# Altium schematic sheet mppt.SchDoc: ChangeMe
size D; Date: Not shown in title block; ApprovedBy: Not shown in title block; CheckedBy: Not shown in title block; Author: Not shown in title block; CompanyName: Not shown in title block; DrawnBy: Not shown in title block; Engineer: Not shown in title block; Organization: Not shown in title block; Address1: Not shown in title block; Address2: Not shown in title block; Address3: Not shown in title block; Address4: Not shown in title block; DocumentNumber: 1; Revision: Use project parameter SCH_Rev; SheetNumber: 1; SheetTotal: 1; PageSetup: Record=PageOptions|CenterHorizontal=True|CenterVertical=True|PrintScale=0.85|XCorrection=0.00|YCorrection=0.00|PrintKind=2|BorderSize=5000000|LeftOffset=0|BottomOffset=0|Orientation=2|PaperLength=1000|PaperWidth=1000|Scale=100|PaperSource=15|PrintQuality=600|MediaType=1|DitherType=10|PaperKind=11x17|PrintScaleMode=0; CurrentTime: Not shown in title block; CurrentDate: Not shown in title block; Time: Not shown in title block; DocumentFullPathAndName: Not shown in title block; DocumentName: Not shown in title block; ModifiedDate: Not shown in title block; ImagePath: Not shown in title block
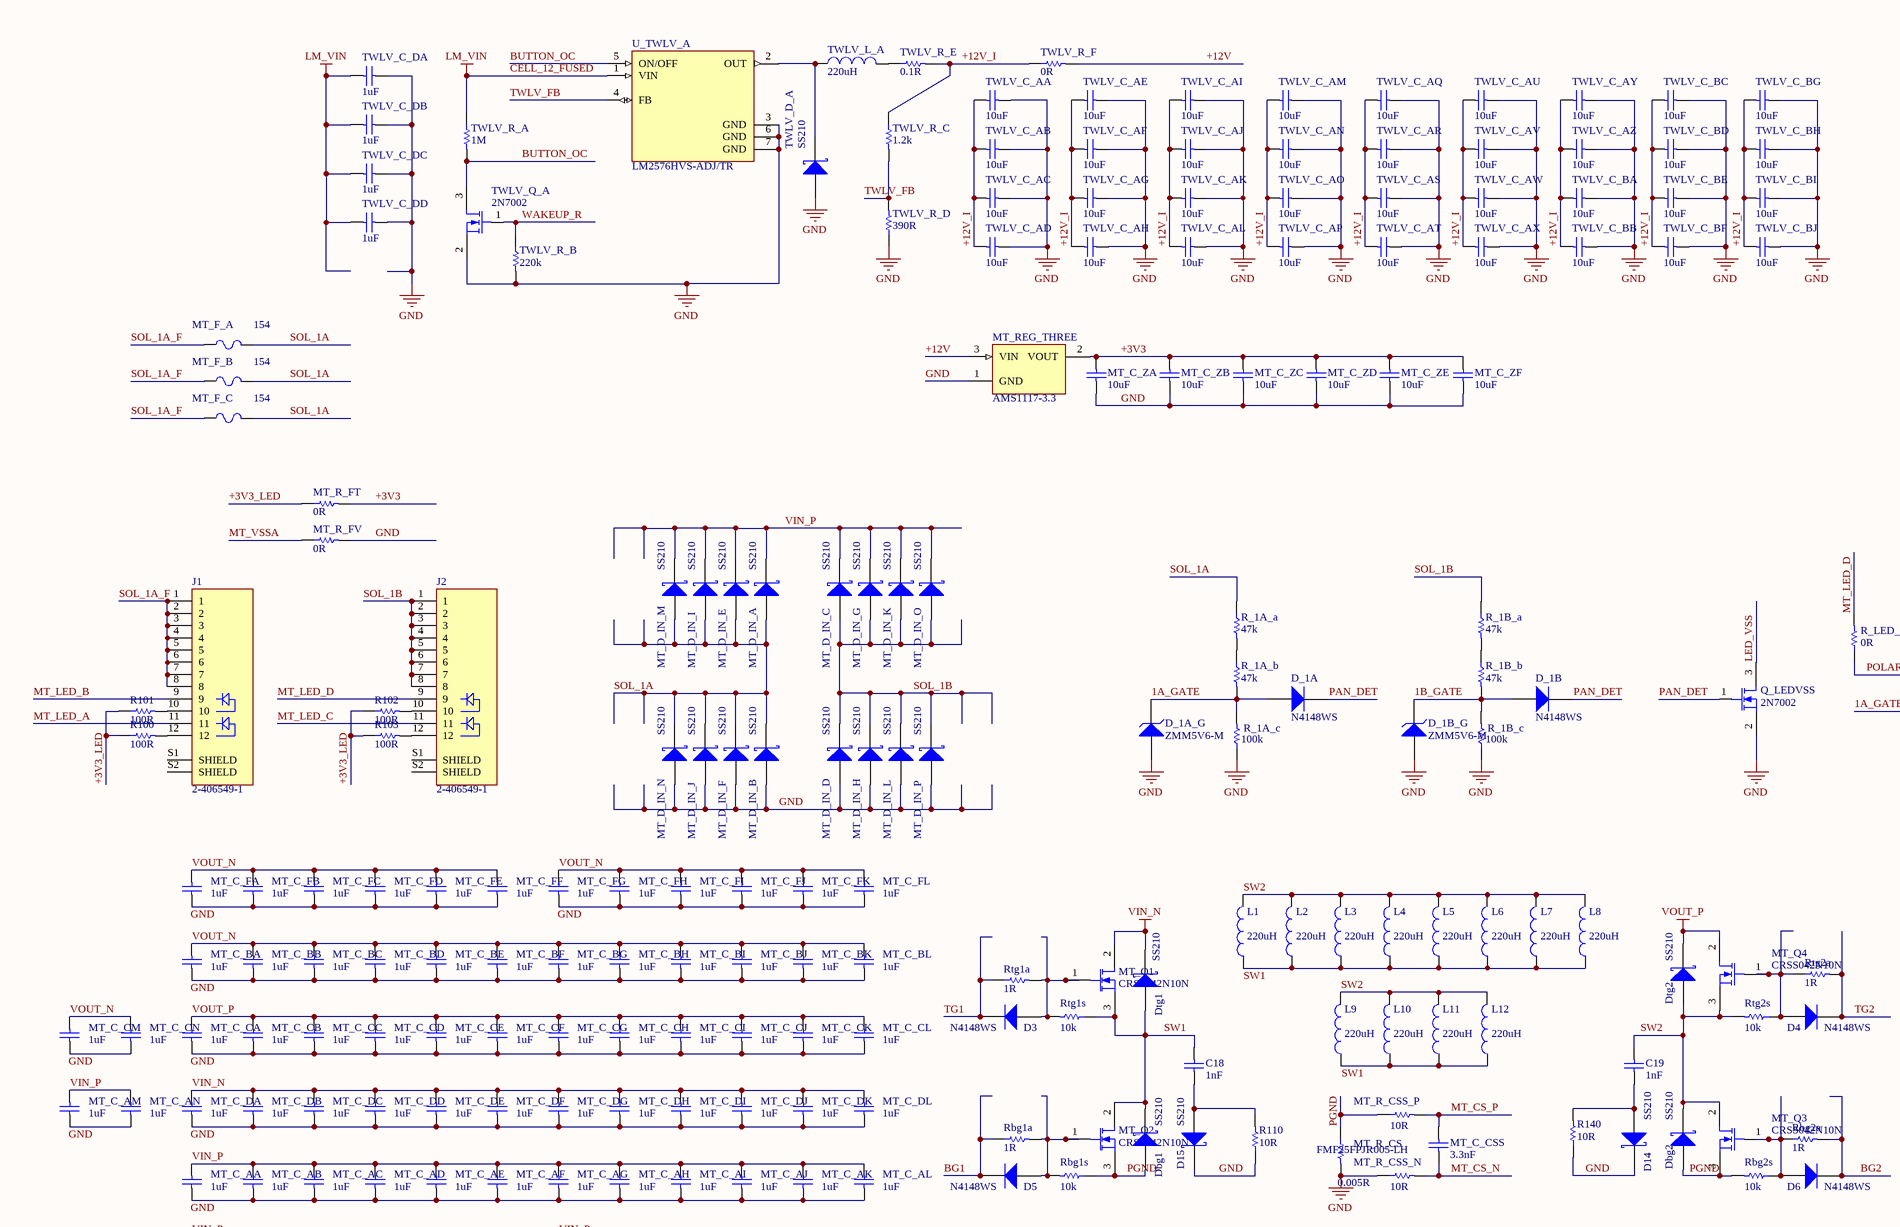
[diagram p0: mppt.SchDoc, top left]
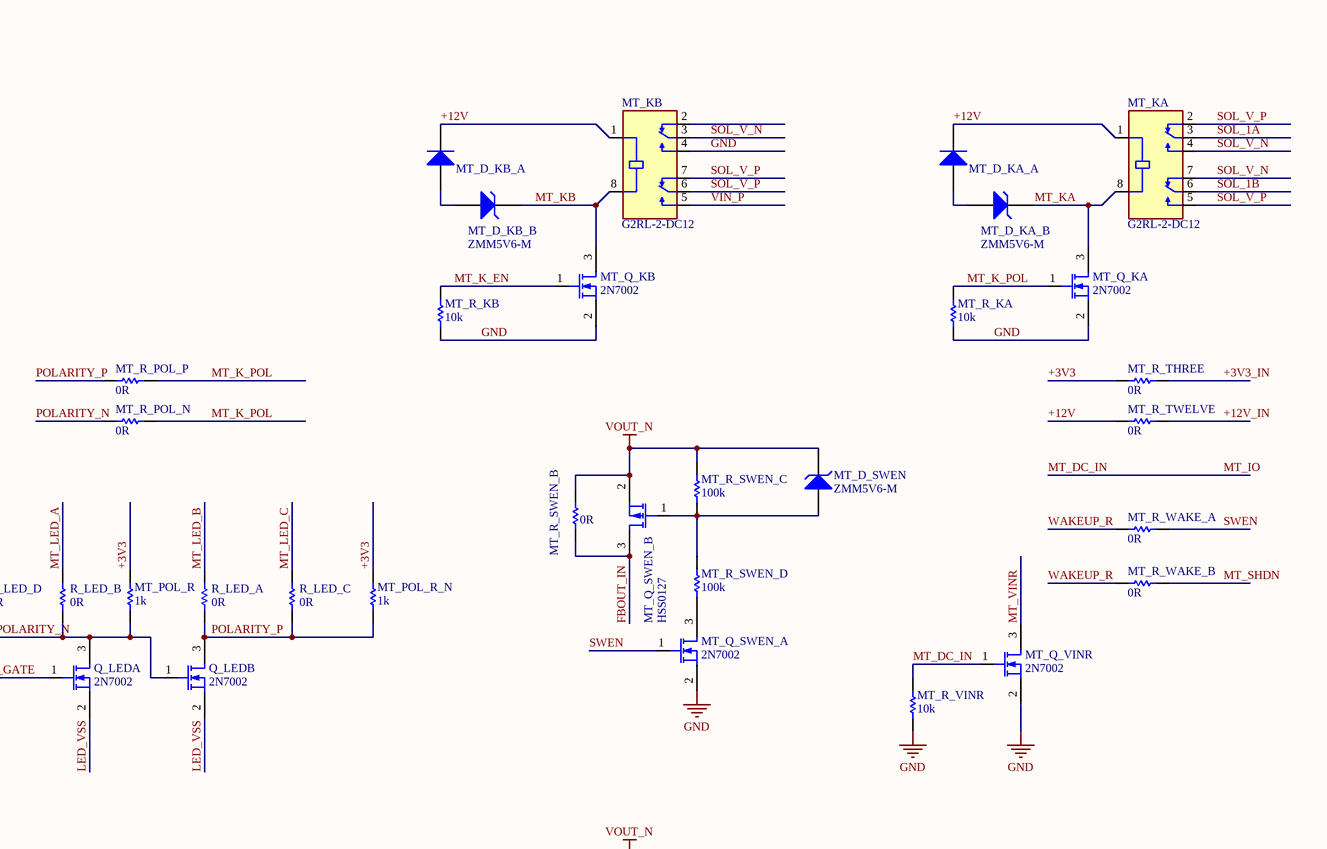
[diagram p1: mppt.SchDoc, top right]
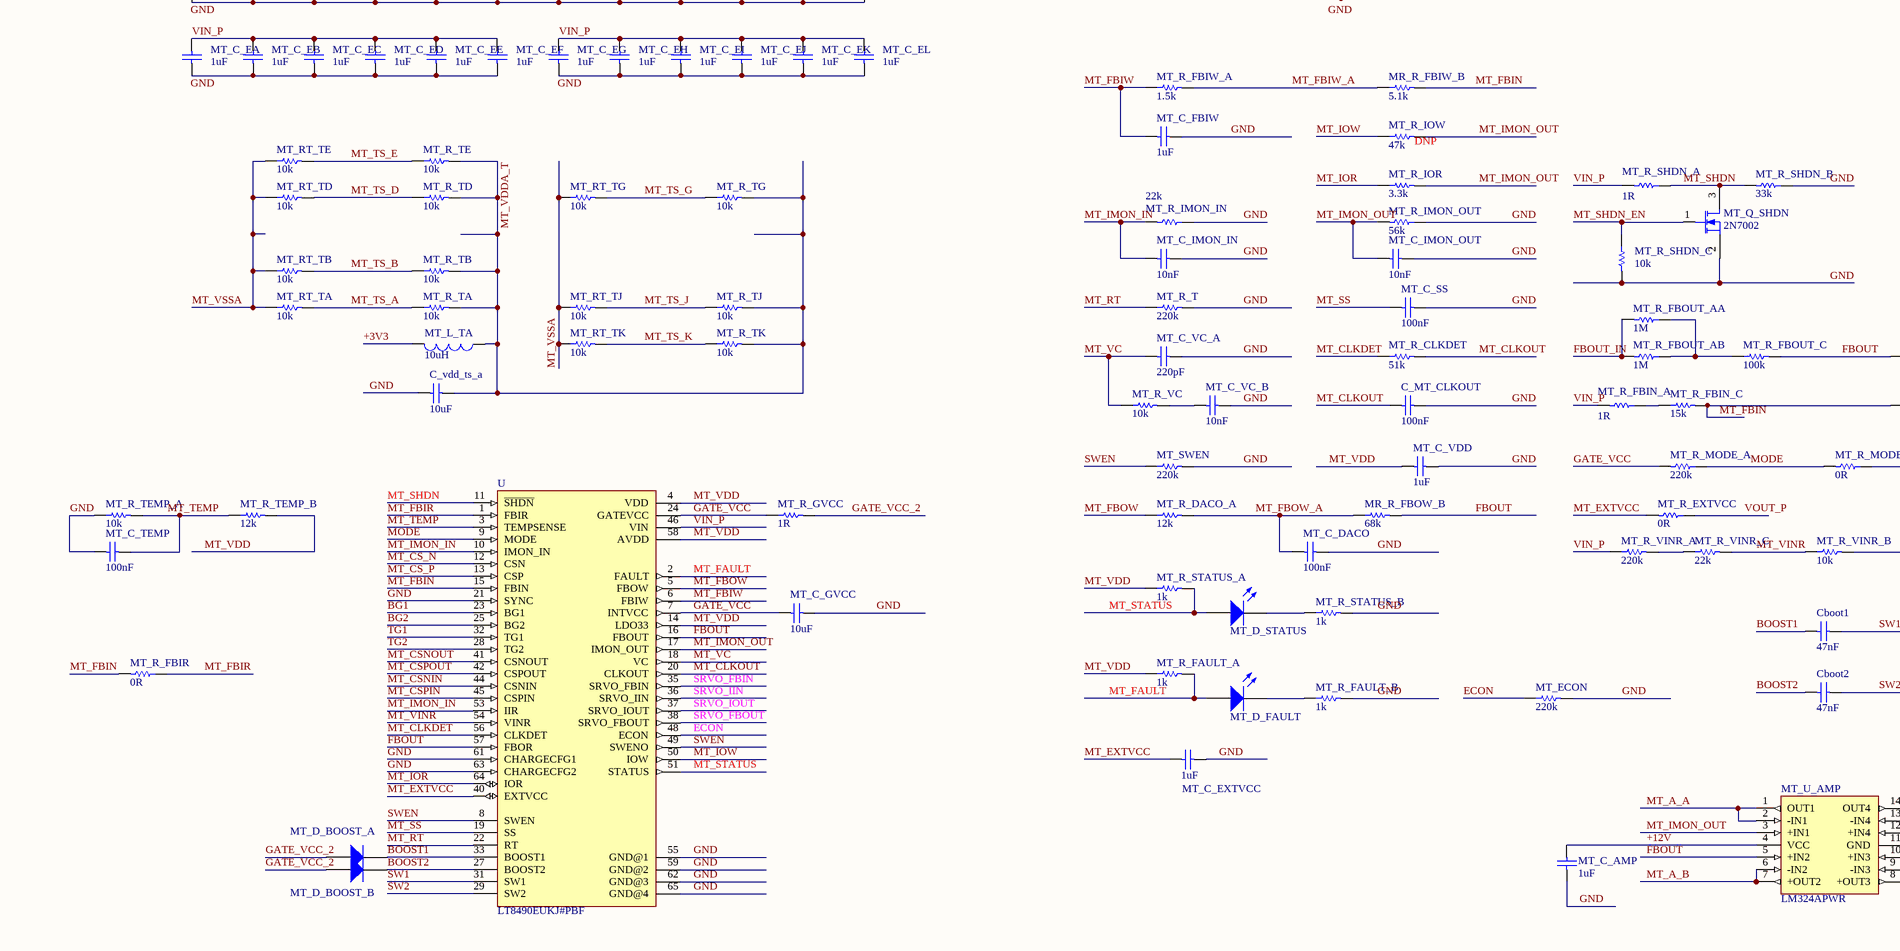
[diagram p2: mppt.SchDoc, bottom left]
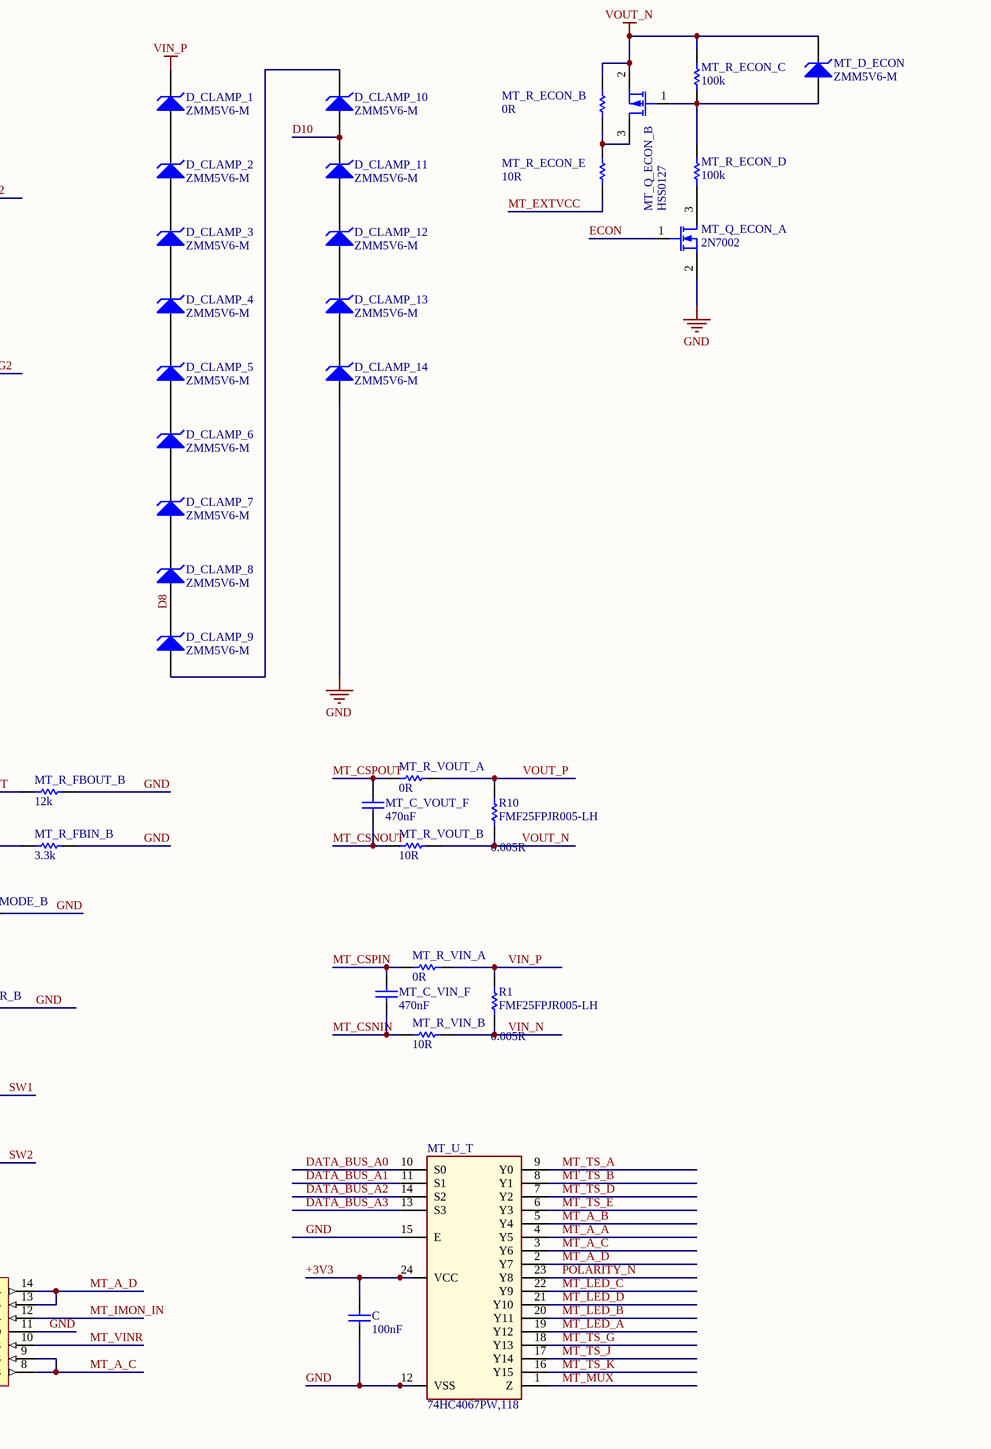
[diagram p3: mppt.SchDoc, bottom right]

## Parts
C  value 100nF  [C_0402]  (hidden comment: CL05B104KO5NNNC)
C18  value 1nF  [C_1206]  (hidden comment: 1206B102K202NT)
C19  value 1nF  [C_1206]  (hidden comment: 1206B102K202NT)
C_MT_CLKOUT  value 100nF  [C_0402]  (hidden comment: CL05B104KO5NNNC)
C_vdd_ts_a  value 10uF  [C_0402]  (hidden comment: CL05A106MQ5NUNC)
Cboot1  value 47nF  [C_0603]  (hidden comment: CL10B474KA8NNNC)
Cboot2  value 47nF  [C_0603]  (hidden comment: CL10B474KA8NNNC)
D3  N4148WS  [SOD-323]
D4  N4148WS  [SOD-323]
D5  N4148WS  [SOD-323]
D6  N4148WS  [SOD-323]
D14  SS210  [DO-214AC]
D15  SS210  [DO-214AC]
D_1A  N4148WS  [SOD-323]
D_1A_G  ZMM5V6-M  [DO-213AA]
D_1B  N4148WS  [SOD-323]
D_1B_G  ZMM5V6-M  [DO-213AA]
D_CLAMP_1  ZMM5V6-M  [DO-213AA]
D_CLAMP_2  ZMM5V6-M  [DO-213AA]
D_CLAMP_3  ZMM5V6-M  [DO-213AA]
D_CLAMP_4  ZMM5V6-M  [DO-213AA]
D_CLAMP_5  ZMM5V6-M  [DO-213AA]
D_CLAMP_6  ZMM5V6-M  [DO-213AA]
D_CLAMP_7  ZMM5V6-M  [DO-213AA]
D_CLAMP_8  ZMM5V6-M  [DO-213AA]
D_CLAMP_9  ZMM5V6-M  [DO-213AA]
D_CLAMP_10  ZMM5V6-M  [DO-213AA]
D_CLAMP_11  ZMM5V6-M  [DO-213AA]
D_CLAMP_12  ZMM5V6-M  [DO-213AA]
D_CLAMP_13  ZMM5V6-M  [DO-213AA]
D_CLAMP_14  ZMM5V6-M  [DO-213AA]
Dbg1  SS210  [DO-214AC]
Dbg2  SS210  [DO-214AC]
Dtg1  SS210  [DO-214AC]
Dtg2  SS210  [DO-214AC]
J1  2-406549-1  [TE_2-406549-1]
J2  2-406549-1  [TE_2-406549-1]
L1  value 220uH  [SRR1260]  (hidden comment: SWRB1207S-221MT)
L2  value 220uH  [SRR1260]  (hidden comment: SWRB1207S-221MT)
L3  value 220uH  [SRR1260]  (hidden comment: SWRB1207S-221MT)
L4  value 220uH  [SRR1260]  (hidden comment: SWRB1207S-221MT)
L5  value 220uH  [SRR1260]  (hidden comment: SWRB1207S-221MT)
L6  value 220uH  [SRR1260]  (hidden comment: SWRB1207S-221MT)
L7  value 220uH  [SRR1260]  (hidden comment: SWRB1207S-221MT)
L8  value 220uH  [SRR1260]  (hidden comment: SWRB1207S-221MT)
L9  value 220uH  [SRR1260]  (hidden comment: SWRB1207S-221MT)
L10  value 220uH  [SRR1260]  (hidden comment: SWRB1207S-221MT)
L11  value 220uH  [SRR1260]  (hidden comment: SWRB1207S-221MT)
L12  value 220uH  [SRR1260]  (hidden comment: SWRB1207S-221MT)
MR_R_FBIW_B  value 5.1k  [R_0402]  (hidden comment: 0402WGF5101TCE)
MR_R_FBOW_B  value 68k  [R_0402]  (hidden comment: 0402WGF6802TCE)
MT_C_AA  value 1uF  [C_1206]  (hidden comment: 1206B105K101NT)
MT_C_AB  value 1uF  [C_1206]  (hidden comment: 1206B105K101NT)
MT_C_AC  value 1uF  [C_1206]  (hidden comment: 1206B105K101NT)
MT_C_AD  value 1uF  [C_1206]  (hidden comment: 1206B105K101NT)
MT_C_AE  value 1uF  [C_1206]  (hidden comment: 1206B105K101NT)
MT_C_AF  value 1uF  [C_1206]  (hidden comment: 1206B105K101NT)
MT_C_AG  value 1uF  [C_1206]  (hidden comment: 1206B105K101NT)
MT_C_AH  value 1uF  [C_1206]  (hidden comment: 1206B105K101NT)
MT_C_AI  value 1uF  [C_1206]  (hidden comment: 1206B105K101NT)
MT_C_AJ  value 1uF  [C_1206]  (hidden comment: 1206B105K101NT)
MT_C_AK  value 1uF  [C_1206]  (hidden comment: 1206B105K101NT)
MT_C_AL  value 1uF  [C_1206]  (hidden comment: 1206B105K101NT)
MT_C_AM  value 1uF  [C_1206]  (hidden comment: 1206B105K101NT)
MT_C_AMP  value 1uF  [C_0402]  (hidden comment: CL05A105KA5NQNC)
MT_C_AN  value 1uF  [C_1206]  (hidden comment: 1206B105K101NT)
MT_C_BA  value 1uF  [C_1206]  (hidden comment: 1206B105K101NT)
MT_C_BB  value 1uF  [C_1206]  (hidden comment: 1206B105K101NT)
MT_C_BC  value 1uF  [C_1206]  (hidden comment: 1206B105K101NT)
MT_C_BD  value 1uF  [C_1206]  (hidden comment: 1206B105K101NT)
MT_C_BE  value 1uF  [C_1206]  (hidden comment: 1206B105K101NT)
MT_C_BF  value 1uF  [C_1206]  (hidden comment: 1206B105K101NT)
MT_C_BG  value 1uF  [C_1206]  (hidden comment: 1206B105K101NT)
MT_C_BH  value 1uF  [C_1206]  (hidden comment: 1206B105K101NT)
MT_C_BI  value 1uF  [C_1206]  (hidden comment: 1206B105K101NT)
MT_C_BJ  value 1uF  [C_1206]  (hidden comment: 1206B105K101NT)
MT_C_BK  value 1uF  [C_1206]  (hidden comment: 1206B105K101NT)
MT_C_BL  value 1uF  [C_1206]  (hidden comment: 1206B105K101NT)
MT_C_CA  value 1uF  [C_1206]  (hidden comment: 1206B105K101NT)
MT_C_CB  value 1uF  [C_1206]  (hidden comment: 1206B105K101NT)
MT_C_CC  value 1uF  [C_1206]  (hidden comment: 1206B105K101NT)
MT_C_CD  value 1uF  [C_1206]  (hidden comment: 1206B105K101NT)
MT_C_CE  value 1uF  [C_1206]  (hidden comment: 1206B105K101NT)
MT_C_CF  value 1uF  [C_1206]  (hidden comment: 1206B105K101NT)
MT_C_CG  value 1uF  [C_1206]  (hidden comment: 1206B105K101NT)
MT_C_CH  value 1uF  [C_1206]  (hidden comment: 1206B105K101NT)
MT_C_CI  value 1uF  [C_1206]  (hidden comment: 1206B105K101NT)
MT_C_CJ  value 1uF  [C_1206]  (hidden comment: 1206B105K101NT)
MT_C_CK  value 1uF  [C_1206]  (hidden comment: 1206B105K101NT)
MT_C_CL  value 1uF  [C_1206]  (hidden comment: 1206B105K101NT)
MT_C_CM  value 1uF  [C_1206]  (hidden comment: 1206B105K101NT)
MT_C_CN  value 1uF  [C_1206]  (hidden comment: 1206B105K101NT)
MT_C_CSS  value 3.3nF  [C_0402]  (hidden comment: CL05B332KB5NNNC)
MT_C_DA  value 1uF  [C_1206]  (hidden comment: 1206B105K101NT)
MT_C_DACO  value 100nF  [C_0402]  (hidden comment: CL05B104KO5NNNC)
MT_C_DB  value 1uF  [C_1206]  (hidden comment: 1206B105K101NT)
MT_C_DC  value 1uF  [C_1206]  (hidden comment: 1206B105K101NT)
MT_C_DD  value 1uF  [C_1206]  (hidden comment: 1206B105K101NT)
MT_C_DE  value 1uF  [C_1206]  (hidden comment: 1206B105K101NT)
MT_C_DF  value 1uF  [C_1206]  (hidden comment: 1206B105K101NT)
MT_C_DG  value 1uF  [C_1206]  (hidden comment: 1206B105K101NT)
MT_C_DH  value 1uF  [C_1206]  (hidden comment: 1206B105K101NT)
MT_C_DI  value 1uF  [C_1206]  (hidden comment: 1206B105K101NT)
MT_C_DJ  value 1uF  [C_1206]  (hidden comment: 1206B105K101NT)
MT_C_DK  value 1uF  [C_1206]  (hidden comment: 1206B105K101NT)
MT_C_DL  value 1uF  [C_1206]  (hidden comment: 1206B105K101NT)
MT_C_EA  value 1uF  [C_1206]  (hidden comment: 1206B105K101NT)
MT_C_EB  value 1uF  [C_1206]  (hidden comment: 1206B105K101NT)
MT_C_EC  value 1uF  [C_1206]  (hidden comment: 1206B105K101NT)
MT_C_ED  value 1uF  [C_1206]  (hidden comment: 1206B105K101NT)
MT_C_EE  value 1uF  [C_1206]  (hidden comment: 1206B105K101NT)
MT_C_EF  value 1uF  [C_1206]  (hidden comment: 1206B105K101NT)
MT_C_EG  value 1uF  [C_1206]  (hidden comment: 1206B105K101NT)
MT_C_EH  value 1uF  [C_1206]  (hidden comment: 1206B105K101NT)
MT_C_EI  value 1uF  [C_1206]  (hidden comment: 1206B105K101NT)
MT_C_EJ  value 1uF  [C_1206]  (hidden comment: 1206B105K101NT)
MT_C_EK  value 1uF  [C_1206]  (hidden comment: 1206B105K101NT)
MT_C_EL  value 1uF  [C_1206]  (hidden comment: 1206B105K101NT)
MT_C_EXTVCC  value 1uF  [C_1206]  (hidden comment: 1206B105K101NT)
MT_C_FA  value 1uF  [C_1206]  (hidden comment: 1206B105K101NT)
MT_C_FB  value 1uF  [C_1206]  (hidden comment: 1206B105K101NT)
MT_C_FBIW  value 1uF  [C_0402]  (hidden comment: CL05A105KA5NQNC)
MT_C_FC  value 1uF  [C_1206]  (hidden comment: 1206B105K101NT)
MT_C_FD  value 1uF  [C_1206]  (hidden comment: 1206B105K101NT)
MT_C_FE  value 1uF  [C_1206]  (hidden comment: 1206B105K101NT)
MT_C_FF  value 1uF  [C_1206]  (hidden comment: 1206B105K101NT)
MT_C_FG  value 1uF  [C_1206]  (hidden comment: 1206B105K101NT)
MT_C_FH  value 1uF  [C_1206]  (hidden comment: 1206B105K101NT)
MT_C_FI  value 1uF  [C_1206]  (hidden comment: 1206B105K101NT)
MT_C_FJ  value 1uF  [C_1206]  (hidden comment: 1206B105K101NT)
MT_C_FK  value 1uF  [C_1206]  (hidden comment: 1206B105K101NT)
MT_C_FL  value 1uF  [C_1206]  (hidden comment: 1206B105K101NT)
MT_C_GVCC  value 10uF  [C_0805]  (hidden comment: GRM21BR61H106KE43L)
MT_C_IMON_IN  value 10nF  [C_0402]  (hidden comment: CL05B103KB5NNNC)
MT_C_IMON_OUT  value 10nF  [C_0402]  (hidden comment: CL05B103KB5NNNC)
MT_C_SS  value 100nF  [C_0402]  (hidden comment: CL05B104KO5NNNC)
MT_C_TEMP  value 100nF  [C_0402]  (hidden comment: CL05B104KO5NNNC)
MT_C_VC_A  value 220pF  [C_0402]  (hidden comment: 0402B221K500NT)
MT_C_VC_B  value 10nF  [C_0402]  (hidden comment: CL05B103KB5NNNC)
MT_C_VDD  value 1uF  [C_0402]  (hidden comment: CL05A105KA5NQNC)
MT_C_VIN_F  value 470nF  [C_0402]  (hidden comment: CL05A474KP5NNNC)
MT_C_VOUT_F  value 470nF  [C_0402]  (hidden comment: CL05A474KP5NNNC)
MT_C_ZA  value 10uF  [C_0402]  (hidden comment: CL05A106MQ5NUNC)
MT_C_ZB  value 10uF  [C_0402]  (hidden comment: CL05A106MQ5NUNC)
MT_C_ZC  value 10uF  [C_0402]  (hidden comment: CL05A106MQ5NUNC)
MT_C_ZD  value 10uF  [C_0402]  (hidden comment: CL05A106MQ5NUNC)
MT_C_ZE  value 10uF  [C_0402]  (hidden comment: CL05A106MQ5NUNC)
MT_C_ZF  value 10uF  [C_0402]  (hidden comment: CL05A106MQ5NUNC)
MT_D_BOOST_A  1N4148WS  [SOD-323]  (value not drawn)
MT_D_BOOST_B  1N4148WS  [SOD-323]  (value not drawn)
MT_D_ECON  ZMM5V6-M  [DO-213AA]
MT_D_FAULT  KT-0603R  [D_0603]  (value not drawn)
MT_D_IN_A  SS210  [DO-214AC]
MT_D_IN_B  SS210  [DO-214AC]
MT_D_IN_C  SS210  [DO-214AC]
MT_D_IN_D  SS210  [DO-214AC]
MT_D_IN_E  SS210  [DO-214AC]
MT_D_IN_F  SS210  [DO-214AC]
MT_D_IN_G  SS210  [DO-214AC]
MT_D_IN_H  SS210  [DO-214AC]
MT_D_IN_I  SS210  [DO-214AC]
MT_D_IN_J  SS210  [DO-214AC]
MT_D_IN_K  SS210  [DO-214AC]
MT_D_IN_L  SS210  [DO-214AC]
MT_D_IN_M  SS210  [DO-214AC]
MT_D_IN_N  SS210  [DO-214AC]
MT_D_IN_O  SS210  [DO-214AC]
MT_D_IN_P  SS210  [DO-214AC]
MT_D_KA_A  1N4148WS  [SOD-323]  (value not drawn)
MT_D_KA_B  ZMM5V6-M  [DO-213AA]
MT_D_KB_A  1N4148WS  [SOD-323]  (value not drawn)
MT_D_KB_B  ZMM5V6-M  [DO-213AA]
MT_D_STATUS  KT-0603R  [D_0603]  (value not drawn)
MT_D_SWEN  ZMM5V6-M  [DO-213AA]
MT_ECON  value 220k  [R_0402]  (hidden comment: 0402WGF2203TCE)
MT_F_A  value 154  [01550900M]  (hidden comment: 01550900M)
MT_F_B  value 154  [01550900M]  (hidden comment: 01550900M)
MT_F_C  value 154  [01550900M]  (hidden comment: 01550900M)
MT_KA  G2RL-2-DC12  [RELAY_G2RL-2_12DC]
MT_KB  G2RL-2-DC12  [RELAY_G2RL-2_12DC]
MT_L_TA  value 10uH  [L_0603]  (hidden comment: SDFL1608S100KTF)
MT_POL_R  value 1k  [R_0402]  (hidden comment: 0402WGF1001TCE)
MT_POL_R_N  value 1k  [R_0402]  (hidden comment: 0402WGF1001TCE)
MT_Q1  CRSS042N10N  [TO-263-3]
MT_Q2  CRSS042N10N  [TO-263-3]
MT_Q3  CRSS042N10N  [TO-263-3]
MT_Q4  CRSS042N10N  [TO-263-3]
MT_Q_ECON_A  2N7002  [TO-236AB]
MT_Q_ECON_B  HSS0127  [TO-236AB]
MT_Q_KA  2N7002  [TO-236AB]
MT_Q_KB  2N7002  [TO-236AB]
MT_Q_SHDN  2N7002  [TO-236AB]
MT_Q_SWEN_A  2N7002  [TO-236AB]
MT_Q_SWEN_B  HSS0127  [TO-236AB]
MT_Q_VINR  2N7002  [TO-236AB]
MT_R_CLKDET  value 51k  [R_0402]  (hidden comment: 0402WGF5102TCE)
MT_R_CS  FMF25FPJR005-LH  value 0.005R  [R_2512]
MT_R_CSS_N  value 10R  [R_0402]  (hidden comment: 0402WGF100JTCE)
MT_R_CSS_P  value 10R  [R_0402]  (hidden comment: 0402WGF100JTCE)
MT_R_DACO_A  value 12k  [R_0402]  (hidden comment: 0402WGF1202TCE)
MT_R_ECON_B  value 0R  [R_0402]  (hidden comment: 0402WGF0000TCE)
MT_R_ECON_C  value 100k  [R_0402]  (hidden comment: 0402WGF1003TCE)
MT_R_ECON_D  value 100k  [R_0402]  (hidden comment: 0402WGF1003TCE)
MT_R_ECON_E  value 10R  [R_0402]  (hidden comment: 0402WGF100JTCE)
MT_R_EXTVCC  value 0R  [R_0402]  (hidden comment: 0402WGF0000TCE)
MT_R_FAULT_A  value 1k  [R_0402]  (hidden comment: 0402WGF1001TCE)
MT_R_FAULT_B  value 1k  [R_0402]  (hidden comment: 0402WGF1001TCE)
MT_R_FBIN_A  value 1R  [R_0603]  (hidden comment: 0603WAF100KT5E)
MT_R_FBIN_B  value 3.3k  [R_0603]  (hidden comment: 0603WAF3301T5E)
MT_R_FBIN_C  value 15k  [R_0402]  (hidden comment: 0402WGF1502TCE)
MT_R_FBIR  value 0R  [R_0402]  (hidden comment: 0402WGF0000TCE)
MT_R_FBIW_A  value 1.5k  [R_0402]  (hidden comment: 0402WGF1501TCE)
MT_R_FBOUT_AA  value 1M  [R_0603]  (hidden comment: 0603WAF1004T5E)
MT_R_FBOUT_AB  value 1M  [R_0603]  (hidden comment: 0603WAF1004T5E)
MT_R_FBOUT_B  value 12k  [R_0402]  (hidden comment: 0402WGF1202TCE)
MT_R_FBOUT_C  value 100k  [R_0402]  (hidden comment: 0402WGF1003TCE)
MT_R_FT  value 0R  [R_0402]  (hidden comment: 0402WGF0000TCE)
MT_R_FV  value 0R  [R_0402]  (hidden comment: 0402WGF0000TCE)
MT_R_GVCC  value 1R  [R_0603]  (hidden comment: 0603WAF100KT5E)
MT_R_IMON_IN  value 22k  [R_0402]  (hidden comment: 0402WGF2202TCE)
MT_R_IMON_OUT  value 56k  [R_0402]  (hidden comment: 0402WGF5602TCE)
MT_R_IOR  value 3.3k  [R_0402]  (hidden comment: 0402WGF3301TCE)
MT_R_IOW  value 47k  [R_0402]  (hidden comment: 0402WGF4702TCE)
MT_R_KA  value 10k  [R_0402]  (hidden comment: 0402WGF1002TCE)
MT_R_KB  value 10k  [R_0402]  (hidden comment: 0402WGF1002TCE)
MT_R_MODE_A  value 220k  [R_0402]  (hidden comment: 0402WGF2203TCE)
MT_R_MODE_B  value 0R  [R_0402]  (hidden comment: 0402WGF0000TCE)
MT_R_POL_N  value 0R  [R_0402]  (hidden comment: 0402WGF0000TCE)
MT_R_POL_P  value 0R  [R_0402]  (hidden comment: 0402WGF0000TCE)
MT_R_SHDN_A  value 1R  [R_0603]  (hidden comment: 0603WAF100KT5E)
MT_R_SHDN_B  value 33k  [R_0402]  (hidden comment: 0402WGF3302TCE)
MT_R_SHDN_C  value 10k  [R_0402]  (hidden comment: 0402WGF1002TCE)
MT_R_STATUS_A  value 1k  [R_0402]  (hidden comment: 0402WGF1001TCE)
MT_R_STATUS_B  value 1k  [R_0402]  (hidden comment: 0402WGF1001TCE)
MT_R_SWEN_B  value 0R  [R_0402]  (hidden comment: 0402WGF0000TCE)
MT_R_SWEN_C  value 100k  [R_0402]  (hidden comment: 0402WGF1003TCE)
MT_R_SWEN_D  value 100k  [R_0402]  (hidden comment: 0402WGF1003TCE)
MT_R_T  value 220k  [R_0402]  (hidden comment: 0402WGF2203TCE)
MT_R_TA  value 10k  [R_0402]  (hidden comment: 0402WGF1002TCE)
MT_R_TB  value 10k  [R_0402]  (hidden comment: 0402WGF1002TCE)
MT_R_TD  value 10k  [R_0402]  (hidden comment: 0402WGF1002TCE)
MT_R_TE  value 10k  [R_0402]  (hidden comment: 0402WGF1002TCE)
MT_R_TEMP_A  value 10k  [R_0402]  (hidden comment: 0402WGF1002TCE)
MT_R_TEMP_B  value 12k  [R_0402]  (hidden comment: 0402WGF1202TCE)
MT_R_TG  value 10k  [R_0402]  (hidden comment: 0402WGF1002TCE)
MT_R_THREE  value 0R  [R_0402]  (hidden comment: 0402WGF0000TCE)
MT_R_TJ  value 10k  [R_0402]  (hidden comment: 0402WGF1002TCE)
MT_R_TK  value 10k  [R_0402]  (hidden comment: 0402WGF1002TCE)
MT_R_TWELVE  value 0R  [R_0402]  (hidden comment: 0402WGF0000TCE)
MT_R_VC  value 10k  [R_0402]  (hidden comment: 0402WGF1002TCE)
MT_R_VIN_A  value 0R  [R_0603]  (hidden comment: 0603WAF0000T5E)
MT_R_VIN_B  value 10R  [R_0603]  (hidden comment: 0603WAF820JT5E)
MT_R_VINR  value 10k  [R_0402]  (hidden comment: 0402WGF1002TCE)
MT_R_VINR_A  value 220k  [R_0402]  (hidden comment: 0402WGF2203TCE)
MT_R_VINR_B  value 10k  [R_0402]  (hidden comment: 0402WGF1002TCE)
MT_R_VINR_C  value 22k  [R_0402]  (hidden comment: 0402WGF2202TCE)
MT_R_VOUT_A  value 0R  [R_0603]  (hidden comment: 0603WAF0000T5E)
MT_R_VOUT_B  value 10R  [R_0603]  (hidden comment: 0603WAF820JT5E)
MT_R_WAKE_A  value 0R  [R_0402]  (hidden comment: 0402WGF0000TCE)
MT_R_WAKE_B  value 0R  [R_0402]  (hidden comment: 0402WGF0000TCE)
MT_REG_THREE  AMS1117-3.3  [TO-261AA]
MT_RT_TA  value 10k  [R_0402]  (hidden comment: NCP15XH103F03RC)
MT_RT_TB  value 10k  [R_0402]  (hidden comment: NCP15XH103F03RC)
MT_RT_TD  value 10k  [R_0402]  (hidden comment: NCP15XH103F03RC)
MT_RT_TE  value 10k  [R_0402]  (hidden comment: NCP15XH103F03RC)
MT_RT_TG  value 10k  [R_0402]  (hidden comment: NCP15XH103F03RC)
MT_RT_TJ  value 10k  [R_0402]  (hidden comment: NCP15XH103F03RC)
MT_RT_TK  value 10k  [R_0402]  (hidden comment: NCP15XH103F03RC)
MT_SWEN  value 220k  [R_0402]  (hidden comment: 0402WGF2203TCE)
MT_U_AMP  LM324APWR  [TSSOP-14-P0.65MM-W4.4MM]
MT_U_T  74HC4067PW,118  [TSSOP-24-P0.65MM-W4.4MM]
Q_LEDA  2N7002  [TO-236AB]
Q_LEDB  2N7002  [TO-236AB]
Q_LEDVSS  2N7002  [TO-236AB]
R1  FMF25FPJR005-LH  value 0.005R  [R_2512]
R10  FMF25FPJR005-LH  value 0.005R  [R_2512]
R100  value 100R  [R_0402]  (hidden comment: 0402WGF1000TCE)
R101  value 100R  [R_0402]  (hidden comment: 0402WGF1000TCE)
R102  value 100R  [R_0402]  (hidden comment: 0402WGF1000TCE)
R103  value 100R  [R_0402]  (hidden comment: 0402WGF1000TCE)
R110  value 10R  [R_1206]  (hidden comment: 1206W4F100JT5E)
R140  value 10R  [R_1206]  (hidden comment: 1206W4F100JT5E)
R_1A_a  value 47k  [R_0402]  (hidden comment: 0402WGF4702TCE)
R_1A_b  value 47k  [R_0402]  (hidden comment: 0402WGF4702TCE)
R_1A_c  value 100k  [R_0402]  (hidden comment: 0402WGF1003TCE)
R_1B_a  value 47k  [R_0402]  (hidden comment: 0402WGF4702TCE)
R_1B_b  value 47k  [R_0402]  (hidden comment: 0402WGF4702TCE)
R_1B_c  value 100k  [R_0402]  (hidden comment: 0402WGF1003TCE)
R_LED_A  value 0R  [R_0402]  (hidden comment: 0402WGF0000TCE)
R_LED_B  value 0R  [R_0402]  (hidden comment: 0402WGF0000TCE)
R_LED_C  value 0R  [R_0402]  (hidden comment: 0402WGF0000TCE)
R_LED_D  value 0R  [R_0402]  (hidden comment: 0402WGF0000TCE)
Rbg1a  value 1R  [R_0603]  (hidden comment: 0603WAF100KT5E)
Rbg1s  value 10k  [R_0402]  (hidden comment: 0402WGF1002TCE)
Rbg2a  value 1R  [R_0603]  (hidden comment: 0603WAF100KT5E)
Rbg2s  value 10k  [R_0402]  (hidden comment: 0402WGF1002TCE)
Rtg1a  value 1R  [R_0603]  (hidden comment: 0603WAF100KT5E)
Rtg1s  value 10k  [R_0402]  (hidden comment: 0402WGF1002TCE)
Rtg2a  value 1R  [R_0603]  (hidden comment: 0603WAF100KT5E)
Rtg2s  value 10k  [R_0402]  (hidden comment: 0402WGF1002TCE)
TWLV_C_AA  value 10uF  [C_0603]  (hidden comment: CL10A106MA8NRNC)
TWLV_C_AB  value 10uF  [C_0603]  (hidden comment: CL10A106MA8NRNC)
TWLV_C_AC  value 10uF  [C_0603]  (hidden comment: CL10A106MA8NRNC)
TWLV_C_AD  value 10uF  [C_0603]  (hidden comment: CL10A106MA8NRNC)
TWLV_C_AE  value 10uF  [C_0603]  (hidden comment: CL10A106MA8NRNC)
TWLV_C_AF  value 10uF  [C_0603]  (hidden comment: CL10A106MA8NRNC)
TWLV_C_AG  value 10uF  [C_0603]  (hidden comment: CL10A106MA8NRNC)
TWLV_C_AH  value 10uF  [C_0603]  (hidden comment: CL10A106MA8NRNC)
TWLV_C_AI  value 10uF  [C_0603]  (hidden comment: CL10A106MA8NRNC)
TWLV_C_AJ  value 10uF  [C_0603]  (hidden comment: CL10A106MA8NRNC)
TWLV_C_AK  value 10uF  [C_0603]  (hidden comment: CL10A106MA8NRNC)
TWLV_C_AL  value 10uF  [C_0603]  (hidden comment: CL10A106MA8NRNC)
TWLV_C_AM  value 10uF  [C_0603]  (hidden comment: CL10A106MA8NRNC)
TWLV_C_AN  value 10uF  [C_0603]  (hidden comment: CL10A106MA8NRNC)
TWLV_C_AO  value 10uF  [C_0603]  (hidden comment: CL10A106MA8NRNC)
TWLV_C_AP  value 10uF  [C_0603]  (hidden comment: CL10A106MA8NRNC)
TWLV_C_AQ  value 10uF  [C_0603]  (hidden comment: CL10A106MA8NRNC)
TWLV_C_AR  value 10uF  [C_0603]  (hidden comment: CL10A106MA8NRNC)
TWLV_C_AS  value 10uF  [C_0603]  (hidden comment: CL10A106MA8NRNC)
TWLV_C_AT  value 10uF  [C_0603]  (hidden comment: CL10A106MA8NRNC)
TWLV_C_AU  value 10uF  [C_0603]  (hidden comment: CL10A106MA8NRNC)
TWLV_C_AV  value 10uF  [C_0603]  (hidden comment: CL10A106MA8NRNC)
TWLV_C_AW  value 10uF  [C_0603]  (hidden comment: CL10A106MA8NRNC)
TWLV_C_AX  value 10uF  [C_0603]  (hidden comment: CL10A106MA8NRNC)
TWLV_C_AY  value 10uF  [C_0603]  (hidden comment: CL10A106MA8NRNC)
TWLV_C_AZ  value 10uF  [C_0603]  (hidden comment: CL10A106MA8NRNC)
TWLV_C_BA  value 10uF  [C_0603]  (hidden comment: CL10A106MA8NRNC)
TWLV_C_BB  value 10uF  [C_0603]  (hidden comment: CL10A106MA8NRNC)
TWLV_C_BC  value 10uF  [C_0603]  (hidden comment: CL10A106MA8NRNC)
TWLV_C_BD  value 10uF  [C_0603]  (hidden comment: CL10A106MA8NRNC)
TWLV_C_BE  value 10uF  [C_0603]  (hidden comment: CL10A106MA8NRNC)
TWLV_C_BF  value 10uF  [C_0603]  (hidden comment: CL10A106MA8NRNC)
TWLV_C_BG  value 10uF  [C_0603]  (hidden comment: CL10A106MA8NRNC)
TWLV_C_BH  value 10uF  [C_0603]  (hidden comment: CL10A106MA8NRNC)
TWLV_C_BI  value 10uF  [C_0603]  (hidden comment: CL10A106MA8NRNC)
TWLV_C_BJ  value 10uF  [C_0603]  (hidden comment: CL10A106MA8NRNC)
TWLV_C_DA  value 1uF  [C_1206]  (hidden comment: 1206B105K101NT)
TWLV_C_DB  value 1uF  [C_1206]  (hidden comment: 1206B105K101NT)
TWLV_C_DC  value 1uF  [C_1206]  (hidden comment: 1206B105K101NT)
TWLV_C_DD  value 1uF  [C_1206]  (hidden comment: 1206B105K101NT)
TWLV_D_A  SS210  [DO-214AC]
TWLV_L_A  value 220uH  [SRR1260]  (hidden comment: SWRB1207S-221MT)
TWLV_Q_A  2N7002  [TO-236AB]
TWLV_R_A  value 1M  [R_0402]  (hidden comment: 0402WGF1004TCE)
TWLV_R_B  value 220k  [R_0402]  (hidden comment: 0402WGF2203TCE)
TWLV_R_C  value 1.2k  [R_0402]  (hidden comment: 0402WGF1201TCE)
TWLV_R_D  value 390R  [R_0603]  (hidden comment: 0603WAF3900T5E)
TWLV_R_E  value 0.1R  [R_1206]  (hidden comment: 1206W4F100LT5E)
TWLV_R_F  value 0R  [R_0402]  (hidden comment: 0402WGF0000TCE)
U  LT8490EUKJ#PBF  [QFN50P700X1100X80-65N]
U_TWLV_A  LM2576HVS-ADJ/TR  [TO-263-5]

## Nets
CELL_12_FUSED: TWLV_C_DA.1 TWLV_C_DB.1 TWLV_C_DC.1 TWLV_C_DD.1 TWLV_R_A.1 U_TWLV_A.1(VIN)  [also labelled LM_VIN]
GND: C.1 C_MT_CLKOUT.2 C_vdd_ts_a.2 D14.1(K) D15.1(K) D_1A_G.2(A) D_1B_G.2(A) D_CLAMP_14.2(A) MT_C_AA.1 MT_C_AB.1 MT_C_AC.1 MT_C_AD.1 MT_C_AE.1 MT_C_AF.1 MT_C_AG.1 MT_C_AH.1 MT_C_AI.1 MT_C_AJ.1 MT_C_AK.1 MT_C_AL.1 MT_C_AM.1 MT_C_AMP.1 MT_C_AN.1 MT_C_BA.1 MT_C_BB.1 MT_C_BC.1 MT_C_BD.1 MT_C_BE.1 MT_C_BF.1 MT_C_BG.1 MT_C_BH.1 MT_C_BI.1 MT_C_BJ.1 MT_C_BK.1 MT_C_BL.1 MT_C_CA.1 MT_C_CB.1 MT_C_CC.1 MT_C_CD.1 MT_C_CE.1 MT_C_CF.1 MT_C_CG.1 MT_C_CH.1 MT_C_CI.1 MT_C_CJ.1 MT_C_CK.1 MT_C_CL.1 MT_C_CM.1 MT_C_CN.1 MT_C_DA.1 MT_C_DACO.2 MT_C_DB.1 MT_C_DC.1 MT_C_DD.1 MT_C_DE.1 MT_C_DF.1 MT_C_DG.1 MT_C_DH.1 MT_C_DI.1 MT_C_DJ.1 MT_C_DK.1 MT_C_DL.1 MT_C_EA.1 MT_C_EB.1 MT_C_EC.1 MT_C_ED.1 MT_C_EE.1 MT_C_EF.1 MT_C_EG.1 MT_C_EH.1 MT_C_EI.1 MT_C_EJ.1 MT_C_EK.1 MT_C_EL.1 MT_C_EXTVCC.2 MT_C_FA.1 MT_C_FB.1 MT_C_FBIW.2 MT_C_FC.1 MT_C_FD.1 MT_C_FE.1 MT_C_FF.1 MT_C_FG.1 MT_C_FH.1 MT_C_FI.1 MT_C_FJ.1 MT_C_FK.1 MT_C_FL.1 MT_C_GVCC.1 MT_C_IMON_IN.1 MT_C_IMON_OUT.1 MT_C_SS.2 MT_C_TEMP.2 MT_C_VC_A.2 MT_C_VC_B.2 MT_C_VDD.1 MT_C_ZA.1 MT_C_ZB.1 MT_C_ZC.1 MT_C_ZD.1 MT_C_ZE.1 MT_C_ZF.1 MT_D_IN_B.2(A) MT_D_IN_D.2(A) MT_D_IN_F.2(A) MT_D_IN_H.2(A) MT_D_IN_J.2(A) MT_D_IN_L.2(A) MT_D_IN_N.2(A) MT_D_IN_P.2(A) MT_ECON.2 MT_KB.4(NO1) MT_Q_ECON_A.2(S) MT_Q_KA.2(S) MT_Q_KB.2(S) MT_Q_SHDN.2(S) MT_Q_SWEN_A.2(S) MT_Q_VINR.2(S) MT_R_CS.2 MT_R_CSS_N.1 MT_R_FAULT_B.2 MT_R_FBIN_B.1 MT_R_FBOUT_B.1 MT_R_FV.2 MT_R_IMON_IN.1 MT_R_IMON_OUT.1 MT_R_KA.2 MT_R_KB.2 MT_R_MODE_B.1 MT_R_SHDN_B.1 MT_R_SHDN_C.2 MT_R_STATUS_B.2 MT_R_T.2 MT_R_TEMP_A.1 MT_R_VINR.2 MT_R_VINR_B.2 MT_REG_THREE.1(GND) MT_SWEN.2 MT_U_AMP.11(GND) MT_U_T.12(VSS) MT_U_T.15(E) Q_LEDVSS.2(S) R110.1 R140.1 R_1A_c.1 R_1B_c.1 TWLV_C_AA.2 TWLV_C_AB.2 TWLV_C_AC.2 TWLV_C_AD.2 TWLV_C_AE.2 TWLV_C_AF.2 TWLV_C_AG.2 TWLV_C_AH.2 TWLV_C_AI.2 TWLV_C_AJ.2 TWLV_C_AK.2 TWLV_C_AL.2 TWLV_C_AM.2 TWLV_C_AN.2 TWLV_C_AO.2 TWLV_C_AP.2 TWLV_C_AQ.2 TWLV_C_AR.2 TWLV_C_AS.2 TWLV_C_AT.2 TWLV_C_AU.2 TWLV_C_AV.2 TWLV_C_AW.2 TWLV_C_AX.2 TWLV_C_AY.2 TWLV_C_AZ.2 TWLV_C_BA.2 TWLV_C_BB.2 TWLV_C_BC.2 TWLV_C_BD.2 TWLV_C_BE.2 TWLV_C_BF.2 TWLV_C_BG.2 TWLV_C_BH.2 TWLV_C_BI.2 TWLV_C_BJ.2 TWLV_C_DA.2 TWLV_C_DB.2 TWLV_C_DC.2 TWLV_C_DD.2 TWLV_D_A.2(A) TWLV_Q_A.2(S) TWLV_R_B.2 TWLV_R_D.1 U.21(SYNC) U.55(GND@1) U.59(GND@2) U.61(CHARGECFG1) U.62(GND@3) U.63(CHARGECFG2) U.65(GND@4) U_TWLV_A.3(GND) U_TWLV_A.6(GND) U_TWLV_A.7(GND)
VIN_N: Dtg1.1(K) MT_C_DA.2 MT_C_DB.2 MT_C_DC.2 MT_C_DD.2 MT_C_DE.2 MT_C_DF.2 MT_C_DG.2 MT_C_DH.2 MT_C_DI.2 MT_C_DJ.2 MT_C_DK.2 MT_C_DL.2 MT_Q1.2(D) MT_R_VIN_B.2 R1.2
VIN_P: D_CLAMP_1.1(K) MT_C_AA.2 MT_C_AB.2 MT_C_AC.2 MT_C_AD.2 MT_C_AE.2 MT_C_AF.2 MT_C_AG.2 MT_C_AH.2 MT_C_AI.2 MT_C_AJ.2 MT_C_AK.2 MT_C_AL.2 MT_C_AM.2 MT_C_AN.2 MT_C_EA.2 MT_C_EB.2 MT_C_EC.2 MT_C_ED.2 MT_C_EE.2 MT_C_EF.2 MT_C_EG.2 MT_C_EH.2 MT_C_EI.2 MT_C_EJ.2 MT_C_EK.2 MT_C_EL.2 MT_D_IN_A.1(K) MT_D_IN_C.1(K) MT_D_IN_E.1(K) MT_D_IN_G.1(K) MT_D_IN_I.1(K) MT_D_IN_K.1(K) MT_D_IN_M.1(K) MT_D_IN_O.1(K) MT_KB.5(NO2) MT_R_FBIN_A.2 MT_R_SHDN_A.2 MT_R_VIN_A.2 MT_R_VINR_A.1 R1.1 U.46(VIN)
VOUT_N: MT_C_BA.2 MT_C_BB.2 MT_C_BC.2 MT_C_BD.2 MT_C_BE.2 MT_C_BF.2 MT_C_BG.2 MT_C_BH.2 MT_C_BI.2 MT_C_BJ.2 MT_C_BK.2 MT_C_BL.2 MT_C_CM.2 MT_C_CN.2 MT_C_FA.2 MT_C_FB.2 MT_C_FC.2 MT_C_FD.2 MT_C_FE.2 MT_C_FF.2 MT_C_FG.2 MT_C_FH.2 MT_C_FI.2 MT_C_FJ.2 MT_C_FK.2 MT_C_FL.2 MT_D_ECON.1(K) MT_D_SWEN.1(K) MT_Q_ECON_B.2(S) MT_Q_SWEN_B.2(S) MT_R_ECON_B.2 MT_R_ECON_C.2 MT_R_SWEN_B.2 MT_R_SWEN_C.2 MT_R_VOUT_B.2 R10.1
VOUT_P: Dtg2.1(K) MT_C_CA.2 MT_C_CB.2 MT_C_CC.2 MT_C_CD.2 MT_C_CE.2 MT_C_CF.2 MT_C_CG.2 MT_C_CH.2 MT_C_CI.2 MT_C_CJ.2 MT_C_CK.2 MT_C_CL.2 MT_Q4.2(D) MT_R_EXTVCC.1 MT_R_VOUT_A.2 R10.2
1A_GATE: D_1A.2(A) D_1A_G.1(K) Q_LEDA.1(G) R_1A_b.2 R_1A_c.2
1B_GATE: D_1B.2(A) D_1B_G.1(K) R_1B_b.2 R_1B_c.2
+3V3: C.2 MT_C_ZA.2 MT_C_ZB.2 MT_C_ZC.2 MT_C_ZD.2 MT_C_ZE.2 MT_C_ZF.2 MT_L_TA.2 MT_POL_R.2 MT_POL_R_N.2 MT_R_FT.2 MT_R_THREE.2 MT_REG_THREE.2(VOUT) MT_U_T.24(VCC)
+3V3_IN: MT_R_THREE.1
+3V3_LED: MT_R_FT.1 R100.1 R101.1 R102.1 R103.1
+12V: MT_C_AMP.2 MT_D_KA_A.1(K) MT_D_KB_A.1(K) MT_KA.1(COIL1) MT_KB.1(COIL1) MT_R_TWELVE.2 MT_REG_THREE.3(VIN) MT_U_AMP.4(VCC) TWLV_R_F.2
+12V_I: TWLV_C_AA.1 TWLV_C_AB.1 TWLV_C_AC.1 TWLV_C_AD.1 TWLV_C_AE.1 TWLV_C_AF.1 TWLV_C_AG.1 TWLV_C_AH.1 TWLV_C_AI.1 TWLV_C_AJ.1 TWLV_C_AK.1 TWLV_C_AL.1 TWLV_C_AM.1 TWLV_C_AN.1 TWLV_C_AO.1 TWLV_C_AP.1 TWLV_C_AQ.1 TWLV_C_AR.1 TWLV_C_AS.1 TWLV_C_AT.1 TWLV_C_AU.1 TWLV_C_AV.1 TWLV_C_AW.1 TWLV_C_AX.1 TWLV_C_AY.1 TWLV_C_AZ.1 TWLV_C_BA.1 TWLV_C_BB.1 TWLV_C_BC.1 TWLV_C_BD.1 TWLV_C_BE.1 TWLV_C_BF.1 TWLV_C_BG.1 TWLV_C_BH.1 TWLV_C_BI.1 TWLV_C_BJ.1 TWLV_R_C.1 TWLV_R_E.2 TWLV_R_F.1
+12V_IN: MT_R_TWELVE.1
BG1: D5.1(K) Rbg1a.1 U.23(BG1)
BG2: D6.1(K) Rbg2a.2 U.25(BG2)
BOOST1: Cboot1.2 MT_D_BOOST_A.1(K) U.33(BOOST1)
BOOST2: Cboot2.2 MT_D_BOOST_B.1(K) U.27(BOOST2)
BUTTON_OC: TWLV_Q_A.3(D) TWLV_R_A.2 U_TWLV_A.5(ON/OFF)
D8: D_CLAMP_8.2(A) D_CLAMP_9.1(K)
D10: D_CLAMP_10.2(A) D_CLAMP_11.1(K)
DATA_BUS_A0: MT_U_T.10(S0)
DATA_BUS_A1: MT_U_T.11(S1)
DATA_BUS_A2: MT_U_T.14(S2)
DATA_BUS_A3: MT_U_T.13(S3)
ECON: MT_ECON.1 MT_Q_ECON_A.1(G) U.48(ECON)
FBOUT: MR_R_FBOW_B.2 MT_R_FBOUT_B.2 MT_R_FBOUT_C.2 MT_U_AMP.5(+IN2) U.16(FBOUT) U.57(FBOR)
FBOUT_IN: MT_Q_SWEN_B.3(D) MT_R_FBOUT_AA.2 MT_R_FBOUT_AB.2 MT_R_SWEN_B.1
GATE_VCC: MT_C_GVCC.2 MT_R_GVCC.1 MT_R_MODE_A.2 U.7(INTVCC) U.24(GATEVCC)
GATE_VCC_2: MT_D_BOOST_A.2(A) MT_D_BOOST_B.2(A) MT_R_GVCC.2
LED_VSS: Q_LEDA.2(S) Q_LEDB.2(S) Q_LEDVSS.3(D)
MODE: MT_R_MODE_A.1 MT_R_MODE_B.2 U.9(MODE)
MT_A_A: MT_U_AMP.1(OUT1) MT_U_AMP.2(-IN1) MT_U_T.4(Y5)
MT_A_B: MT_U_AMP.6(-IN2) MT_U_AMP.7(+OUT2) MT_U_T.5(Y4)
MT_A_C: MT_U_AMP.8(+OUT3) MT_U_AMP.9(-IN3) MT_U_T.3(Y6)
MT_A_D: MT_U_AMP.13(-IN4) MT_U_AMP.14(OUT4) MT_U_T.2(Y7)
MT_CLKDET: MT_R_CLKDET.1 U.56(CLKDET)
MT_CLKOUT: C_MT_CLKOUT.1 MT_R_CLKDET.2 U.20(CLKOUT)
MT_CS_N: MT_C_CSS.1 MT_R_CSS_N.2 U.12(CSN)
MT_CS_P: MT_C_CSS.2 MT_R_CSS_P.2 U.13(CSP)
MT_CSNIN: MT_C_VIN_F.1 MT_R_VIN_B.1 U.44(CSNIN)
MT_CSNOUT: MT_C_VOUT_F.1 MT_R_VOUT_B.1 U.41(CSNOUT)
MT_CSPIN: MT_C_VIN_F.2 MT_R_VIN_A.1 U.45(CSPIN)
MT_CSPOUT: MT_C_VOUT_F.2 MT_R_VOUT_A.1 U.42(CSPOUT)
MT_DC_IN: MT_Q_VINR.1(G) MT_R_VINR.1  [also labelled MT_IO]
MT_EXTVCC: MT_C_EXTVCC.1 MT_R_ECON_E.1 MT_R_EXTVCC.2 U.40(EXTVCC)
MT_FAULT: MT_D_FAULT.2(A) MT_R_FAULT_A.2 U.2(FAULT)
MT_FBIN: MR_R_FBIW_B.2 MT_R_FBIN_B.2 MT_R_FBIN_C.2 MT_R_FBIR.2 U.15(FBIN)
MT_FBIR: MT_R_FBIR.1 U.1(FBIR)
MT_FBIW: MT_C_FBIW.1 MT_R_FBIW_A.1 U.6(FBIW)
MT_FBIW_A: MR_R_FBIW_B.1 MT_R_FBIW_A.2
MT_FBOW: MT_R_DACO_A.1 U.5(FBOW)
MT_FBOW_A: MR_R_FBOW_B.1 MT_C_DACO.1 MT_R_DACO_A.2
MT_IMON_IN: MT_C_IMON_IN.2 MT_R_IMON_IN.2 MT_U_AMP.12(+IN4) U.10(IMON_IN) U.53(IIR)
MT_IMON_OUT: MT_C_IMON_OUT.2 MT_R_IMON_OUT.2 MT_R_IOR.2 MT_R_IOW.2 MT_U_AMP.3(+IN1) U.17(IMON_OUT)
MT_IOR: MT_R_IOR.1 U.64(IOR)
MT_IOW: MT_R_IOW.1 U.50(IOW)
MT_K_EN: MT_Q_KB.1(G) MT_R_KB.1
MT_K_POL: MT_Q_KA.1(G) MT_R_KA.1 MT_R_POL_N.1 MT_R_POL_P.1
MT_KA: MT_D_KA_B.1(K) MT_KA.8(COIL2) MT_Q_KA.3(D)
MT_KB: MT_D_KB_B.1(K) MT_KB.8(COIL2) MT_Q_KB.3(D)
MT_LED_A: J1.11 MT_U_T.19(Y12) R_LED_B.2
MT_LED_B: J1.9 MT_U_T.20(Y11) R_LED_A.2
MT_LED_C: J2.11 MT_U_T.22(Y9) R_LED_C.2
MT_LED_D: J2.9 MT_U_T.21(Y10) R_LED_D.2
MT_MUX: MT_U_T.1(Z)
MT_RT: MT_R_T.1 U.22(RT)
MT_SHDN: MT_Q_SHDN.3(D) MT_R_SHDN_A.1 MT_R_SHDN_B.2 MT_R_WAKE_B.1 U.11(~{SHDN})
MT_SHDN_EN: MT_Q_SHDN.1(G) MT_R_SHDN_C.1
MT_SS: MT_C_SS.1 U.19(SS)
MT_STATUS: MT_D_STATUS.2(A) MT_R_STATUS_A.2 U.51(STATUS)
MT_TEMP: MT_C_TEMP.1 MT_R_TEMP_A.2 MT_R_TEMP_B.1 U.3(TEMPSENSE)
MT_TS_A: MT_R_TA.1 MT_RT_TA.2 MT_U_T.9(Y0)
MT_TS_B: MT_R_TB.1 MT_RT_TB.2 MT_U_T.8(Y1)
MT_TS_D: MT_R_TD.1 MT_RT_TD.2 MT_U_T.7(Y2)
MT_TS_E: MT_R_TE.1 MT_RT_TE.2 MT_U_T.6(Y3)
MT_TS_G: MT_R_TG.1 MT_RT_TG.2 MT_U_T.18(Y13)
MT_TS_J: MT_R_TJ.1 MT_RT_TJ.2 MT_U_T.17(Y14)
MT_TS_K: MT_R_TK.1 MT_RT_TK.2 MT_U_T.16(Y15)
MT_VC: MT_C_VC_A.1 MT_R_VC.1 U.18(VC)
MT_VDD: MT_C_VDD.2 MT_R_FAULT_A.1 MT_R_STATUS_A.1 MT_R_TEMP_B.2 U.4(VDD) U.14(LDO33) U.58(AVDD)
MT_VDDA_T: C_vdd_ts_a.1 MT_L_TA.1 MT_R_TA.2 MT_R_TB.2 MT_R_TD.2 MT_R_TE.2 MT_R_TG.2 MT_R_TJ.2 MT_R_TK.2
MT_VINR: MT_Q_VINR.3(D) MT_R_VINR_B.1 MT_R_VINR_C.2 MT_U_AMP.10(+IN3) U.54(VINR)
MT_VSSA: MT_R_FV.1 MT_RT_TA.1 MT_RT_TB.1 MT_RT_TD.1 MT_RT_TE.1 MT_RT_TG.1 MT_RT_TJ.1 MT_RT_TK.1
PAN_DET: D_1A.1(K) D_1B.1(K) Q_LEDVSS.1(G)
PGND: Dbg1.2(A) Dbg2.2(A) MT_Q2.3(S) MT_Q3.3(S) MT_R_CS.1 MT_R_CSS_P.1 Rbg1s.1 Rbg2s.2
POLARITY_N: MT_POL_R.1 MT_R_POL_N.2 MT_U_T.23(Y8) Q_LEDA.3(D) Q_LEDB.1(G) R_LED_B.1 R_LED_D.1
POLARITY_P: MT_POL_R_N.1 MT_R_POL_P.2 Q_LEDB.3(D) R_LED_A.1 R_LED_C.1
SOL_1A: MT_D_IN_A.2(A) MT_D_IN_B.1(K) MT_D_IN_E.2(A) MT_D_IN_F.1(K) MT_D_IN_I.2(A) MT_D_IN_J.1(K) MT_D_IN_M.2(A) MT_D_IN_N.1(K) MT_F_A.2 MT_F_B.2 MT_F_C.2 MT_KA.3(COM1) R_1A_a.1
SOL_1A_F: J1.1 J1.2 J1.3 J1.4 J1.5 J1.6 J1.7 J1.8 MT_F_A.1 MT_F_B.1 MT_F_C.1
SOL_1B: J2.1 J2.2 J2.3 J2.4 J2.5 J2.6 J2.7 J2.8 MT_D_IN_C.2(A) MT_D_IN_D.1(K) MT_D_IN_G.2(A) MT_D_IN_H.1(K) MT_D_IN_K.2(A) MT_D_IN_L.1(K) MT_D_IN_O.2(A) MT_D_IN_P.1(K) MT_KA.6(COM2) R_1B_a.1
SOL_V_N: MT_KA.4(NO1) MT_KA.7(NC2) MT_KB.3(COM1)
SOL_V_P: MT_KA.2(NC1) MT_KA.5(NO2) MT_KB.6(COM2) MT_KB.7(NC2)
SRVO_FBIN: U.35(SRVO_FBIN)
SRVO_FBOUT: U.38(SRVO_FBOUT)
SRVO_IIN: U.36(SRVO_IIN)
SRVO_IOUT: U.37(SRVO_IOUT)
SW1: C18.2 Cboot1.1 Dbg1.1(K) Dtg1.2(A) L1.1 L2.1 L3.1 L4.1 L5.1 L6.1 L7.1 L8.1 L9.1 L10.1 L11.1 L12.1 MT_Q1.3(S) MT_Q2.2(D) Rtg1s.1 U.31(SW1)
SW2: C19.2 Cboot2.1 Dbg2.1(K) Dtg2.2(A) L1.2 L2.2 L3.2 L4.2 L5.2 L6.2 L7.2 L8.2 L9.2 L10.2 L11.2 L12.2 MT_Q3.2(D) MT_Q4.3(S) Rtg2s.2 U.29(SW2)
SWEN: MT_Q_SWEN_A.1(G) MT_R_WAKE_A.1 MT_SWEN.1 U.8(SWEN) U.49(SWENO)
TG1: D3.1(K) Rtg1a.1 U.32(TG1)
TG2: D4.1(K) Rtg2a.2 U.28(TG2)
TWLV_FB: TWLV_R_C.2 TWLV_R_D.2 U_TWLV_A.4(FB)
WAKEUP_R: MT_R_WAKE_A.2 MT_R_WAKE_B.2 TWLV_Q_A.1(G) TWLV_R_B.1
NetC18_1: C18.1 D15.2(A) R110.2
NetC19_1: C19.1 D14.2(A) R140.2
NetD3_2: D3.2(A) MT_Q1.1(G) Rtg1a.2 Rtg1s.2
NetD4_2: D4.2(A) MT_Q4.1(G) Rtg2a.1 Rtg2s.1
NetD5_2: D5.2(A) MT_Q2.1(G) Rbg1a.2 Rbg1s.2
NetD6_2: D6.2(A) MT_Q3.1(G) Rbg2a.1 Rbg2s.1
NetD_CLAMP_1_2: D_CLAMP_1.2(A) D_CLAMP_2.1(K)
NetD_CLAMP_2_2: D_CLAMP_2.2(A) D_CLAMP_3.1(K)
NetD_CLAMP_3_2: D_CLAMP_3.2(A) D_CLAMP_4.1(K)
NetD_CLAMP_4_2: D_CLAMP_4.2(A) D_CLAMP_5.1(K)
NetD_CLAMP_5_2: D_CLAMP_5.2(A) D_CLAMP_6.1(K)
NetD_CLAMP_6_2: D_CLAMP_6.2(A) D_CLAMP_7.1(K)
NetD_CLAMP_7_2: D_CLAMP_7.2(A) D_CLAMP_8.1(K)
NetD_CLAMP_9_2: D_CLAMP_9.2(A) D_CLAMP_10.1(K)
NetD_CLAMP_11_2: D_CLAMP_11.2(A) D_CLAMP_12.1(K)
NetD_CLAMP_12_2: D_CLAMP_12.2(A) D_CLAMP_13.1(K)
NetD_CLAMP_13_2: D_CLAMP_13.2(A) D_CLAMP_14.1(K)
NetJ1_10: J1.10 R101.2
NetJ1_12: J1.12 R100.2
NetJ2_10: J2.10 R102.2
NetJ2_12: J2.12 R103.2
NetMT_C_VC_B_1: MT_C_VC_B.1 MT_R_VC.2
NetMT_D_ECON_2: MT_D_ECON.2(A) MT_Q_ECON_B.1(G) MT_R_ECON_C.1 MT_R_ECON_D.2
NetMT_D_FAULT_1: MT_D_FAULT.1(K) MT_R_FAULT_B.1
NetMT_D_KA_A_2: MT_D_KA_A.2(A) MT_D_KA_B.2(A)
NetMT_D_KB_A_2: MT_D_KB_A.2(A) MT_D_KB_B.2(A)
NetMT_D_STATUS_1: MT_D_STATUS.1(K) MT_R_STATUS_B.1
NetMT_D_SWEN_2: MT_D_SWEN.2(A) MT_Q_SWEN_B.1(G) MT_R_SWEN_C.1 MT_R_SWEN_D.2
NetMT_Q_ECON_A_3: MT_Q_ECON_A.3(D) MT_R_ECON_D.1
NetMT_Q_ECON_B_3: MT_Q_ECON_B.3(D) MT_R_ECON_B.1 MT_R_ECON_E.2
NetMT_Q_SWEN_A_3: MT_Q_SWEN_A.3(D) MT_R_SWEN_D.1
NetMT_R_FBIN_A_1: MT_R_FBIN_A.1 MT_R_FBIN_C.1
NetMT_R_FBOUT_AA_1: MT_R_FBOUT_AA.1 MT_R_FBOUT_AB.1 MT_R_FBOUT_C.1
NetMT_R_VINR_A_2: MT_R_VINR_A.2 MT_R_VINR_C.1
NetR_1A_a_2: R_1A_a.2 R_1A_b.1
NetR_1B_a_2: R_1B_a.2 R_1B_b.1
NetTWLV_D_A_1: TWLV_D_A.1(K) TWLV_L_A.1 U_TWLV_A.2(OUT)
NetTWLV_L_A_2: TWLV_L_A.2 TWLV_R_E.1

Not connected (* = marked no-connect by the designer): J1 S1(SHIELD) S2(SHIELD); J2 S1(SHIELD) S2(SHIELD); MT_KB 2(NC1)

## Notes on the sheet
- (near MT_R_IOW) DNP
- Title
- Size:
- Date:
- File:
- D
- Number:
- Time:
- Revision:
- Sheet
- of

## Library data of the parts
C C_MT_CLKOUT MT_C_DACO MT_C_SS MT_C_TEMP = CL05B104KO5NNNC: C - CAPACITOR - MLCC - 100nF - 16V - 0402; WVDC: 16; LCSC Part #: C1525; JLC Availability: Basic
C18 C19 = 1206B102K202NT: C - CAPACITOR - MLCC - 1nF - 2000V - 1206 - X7R; WVDC: 2000; LCSC Part #: C9196; JLC Availability: Basic
C_vdd_ts_a MT_C_ZA MT_C_ZB MT_C_ZC MT_C_ZD MT_C_ZE MT_C_ZF = CL05A106MQ5NUNC: C - CAPACITOR - MLCC - 10uF - 6.3V - 0402; WVDC: 6.3; LCSC Part #: C15525; JLC Availability: Basic
Cboot1 Cboot2 = CL10B474KA8NNNC: C - CAPACITOR - MLCC - 470nF - 25V - 0603; WVDC: 25; LCSC Part #: C1623; JLC Availability: Basic
D3-D6 D_1A D_1B = N4148WS: D - DIODE - FAST TRR - 100V - 150mA - 4ns; LCSC Part #: C2128; JLC Availability: Basic; PIV: 100V; If: 150mA; Trr: 4ns
D14 D15 Dbg1 Dbg2 Dtg1 Dtg2 MT_D_IN_A MT_D_IN_B MT_D_IN_C MT_D_IN_D MT_D_IN_E MT_D_IN_F MT_D_IN_G MT_D_IN_H MT_D_IN_I MT_D_IN_J MT_D_IN_K MT_D_IN_L MT_D_IN_M MT_D_IN_N MT_D_IN_O MT_D_IN_P TWLV_D_A = SS210: D - DIODE - SCHOTTKY - 100V - 2A; Vrrm: 100; If: 2A; LCSC Part #: C14996; JLC Availability: Extended
D_1A_G D_1B_G D_CLAMP_1-D_CLAMP_14 MT_D_ECON MT_D_KA_B MT_D_KB_B MT_D_SWEN = ZMM5V6-M: D - DIODE - ZENER - 5.6V - 500mW; LCSC Part #: C8062; JLC Availability: BASIC
J1 J2 = 2-406549-1: J - JACK - ETHERNET - Right - THT; LCSC Part #: C125068; JLC Availability: Extended
L1-L12 TWLV_L_A = SWRB1207S-221MT: L - INDUCTOR - 220uH - 1.6A - 12.5mm; Isat: 1.6A; LCSC Part #: C169380; JLC Availability: Extended
MR_R_FBIW_B = 0402WGF5101TCE: R - RESISTOR - SMD - 5.1k - 1% - 0402; LCSC Part #: C25905; JLC Availability: Basic
MR_R_FBOW_B = 0402WGF6802TCE: R - RESISTOR - SMD - 68k - 1% - 0402; LCSC Part #: C36871; JLC Availability: Basic
MT_C_AA MT_C_AB MT_C_AC MT_C_AD MT_C_AE MT_C_AF MT_C_AG MT_C_AH MT_C_AI MT_C_AJ MT_C_AK MT_C_AL MT_C_AM MT_C_AN MT_C_BA MT_C_BB MT_C_BC MT_C_BD MT_C_BE MT_C_BF MT_C_BG MT_C_BH MT_C_BI MT_C_BJ MT_C_BK MT_C_BL MT_C_CA MT_C_CB MT_C_CC MT_C_CD MT_C_CE MT_C_CF MT_C_CG MT_C_CH MT_C_CI MT_C_CJ MT_C_CK MT_C_CL MT_C_CM MT_C_CN MT_C_DA MT_C_DB MT_C_DC MT_C_DD MT_C_DE MT_C_DF MT_C_DG MT_C_DH MT_C_DI MT_C_DJ MT_C_DK MT_C_DL MT_C_EA MT_C_EB MT_C_EC MT_C_ED MT_C_EE MT_C_EF MT_C_EG MT_C_EH MT_C_EI MT_C_EJ MT_C_EK MT_C_EL MT_C_EXTVCC MT_C_FA MT_C_FB MT_C_FC MT_C_FD MT_C_FE MT_C_FF MT_C_FG MT_C_FH MT_C_FI MT_C_FJ MT_C_FK MT_C_FL TWLV_C_DA TWLV_C_DB TWLV_C_DC TWLV_C_DD = 1206B105K101NT: C - CAPACITOR - MLCC - 1uF - 100V - 1206 - X7R; WVDC: 100; LCSC Part #: C91151; JLC Availability: Extended
MT_C_AMP MT_C_FBIW MT_C_VDD = CL05A105KA5NQNC: C - CAPACITOR - MLCC - 1uF - 25V - 0402; WVDC: 16; LCSC Part #: C52923; JLC Availability: Basic
MT_C_CSS = CL05B332KB5NNNC: C - CAPACITOR - MLCC - 3.3nF - 50V - 0402; WVDC: 50; LCSC Part #: C26404; JLC Availability: Basic
MT_C_GVCC = GRM21BR61H106KE43L: C - CAPACITOR - MLCC - 10uF - 50V - 0805; WVDC: 50; LCSC Part #: C440198; Availability: Basic
MT_C_IMON_IN MT_C_IMON_OUT MT_C_VC_B = CL05B103KB5NNNC: C - CAPACITOR - MLCC - 10nF - 50V - 0402; WVDC: 50; LCSC Part #: C15195; JLC Availability: Basic
MT_C_VC_A = 0402B221K500NT: C - CAPACITOR - MLCC - 220pF - 50V - 0402; WVDC: 50; LCSC Part #: C1530; JLC Availability: Basic
MT_C_VIN_F MT_C_VOUT_F = CL05A474KP5NNNC: C - CAPACITOR - MLCC - 470nF - 10V - 0402; WVDC: 10; LCSC Part #: C47339; JLC Availability: Basic
MT_D_BOOST_A MT_D_BOOST_B MT_D_KA_A MT_D_KB_A = 1N4148WS: D - DIODE - FAST TRR - 100V - 150mA - 4ns; LCSC Part #: C2128; JLC Availability: Basic; PIV: 100V; If: 150mA; Trr: 4ns
MT_D_FAULT MT_D_STATUS = KT-0603R: D - LED - 0603 - Red; LCSC Part #: C2286; JLC Availability: Basic
MT_ECON MT_R_MODE_A MT_R_T MT_R_VINR_A MT_SWEN TWLV_R_B = 0402WGF2203TCE: R - RESISTOR - SMD - 220k - 1% - 0402; LCSC Part #: C25767; JLC Availability: Basic
MT_F_A MT_F_B MT_F_C = 01550900M: F - FUSE - FUSEHOLDER - 154 - SMD; JLC Availability: Extended; LCSC Part #: C108518
MT_KA MT_KB = G2RL-2-DC12: SW - Relay 12VDC 8A DPDT (( 29mm 12.7mm 15.7mm)) THT; Coil: 12V; MF: Omron; MP: G2RL-2-DC12; Current: 8A; Availability: Extended; Value: *; Type: DPDT; LCSC Part #: C61458
MT_L_TA = SDFL1608S100KTF: L - INDUCTOR - 10uH - 0603; LCSC Part #: C1035; JLC Availability: Basic
MT_POL_R MT_POL_R_N MT_R_FAULT_A MT_R_FAULT_B MT_R_STATUS_A MT_R_STATUS_B = 0402WGF1001TCE: R - RESISTOR - SMD - 1k - 1% - 0402; LCSC Part #: C11702; JLC Availability: Basic
MT_Q1-MT_Q4 = CRSS042N10N: Q - TRANSISTOR - MOSFET (N) - 100V - 120A - 0.005R; WVDC: 100; LCSC Part #: C410926; JLC Availability: Extended
MT_Q_ECON_A MT_Q_KA MT_Q_KB MT_Q_SHDN MT_Q_SWEN_A MT_Q_VINR Q_LEDA Q_LEDB Q_LEDVSS TWLV_Q_A = 2N7002: Q - TRANSISTOR - MOSFET (N) - 60V - 200mW; WVDC: 60; JLC Availability: Basic; LCSC Part #: C8545
MT_Q_ECON_B MT_Q_SWEN_B = HSS0127: Q - TRANSISTOR - MOSFET (P) - 100V - 0.9A - 0.65 Ohm; WVDC: 100; JLC Availability: Extended; LCSC Part #: C700960
MT_R_CLKDET = 0402WGF5102TCE: R - RESISTOR - SMD - 51k - 1% - 0402; LCSC Part #: C25794; JLC Availability: Basic
MT_R_CS R1 R10 = FMF25FPJR005-LH: R - RESISTOR - SMD - 0.005R - 1% - 2512 - 2W; LCSC Part #: C371096; JLC Availability: Extended; ComponentLink1URL: http://riedon.com/media/pdf/CSR.pdf; ComponentLink1Description: http://riedon.com/media/pdf/CSR.pdf
MT_R_CSS_N MT_R_CSS_P MT_R_ECON_E = 0402WGF100JTCE: R - RESISTOR - SMD - 10R - 1% - 0402; LCSC Part #: C25077; JLC Availability: Basic
MT_R_DACO_A MT_R_FBOUT_B MT_R_TEMP_B = 0402WGF1202TCE: R - RESISTOR - SMD - 12k - 1% - 0402; LCSC Part #: C25752; JLC Availability: Basic
MT_R_ECON_B MT_R_EXTVCC MT_R_FBIR MT_R_FT MT_R_FV MT_R_MODE_B MT_R_POL_N MT_R_POL_P MT_R_SWEN_B MT_R_THREE MT_R_TWELVE MT_R_WAKE_A MT_R_WAKE_B R_LED_A R_LED_B R_LED_C R_LED_D TWLV_R_F = 0402WGF0000TCE: R - RESISTOR - SMD - 0R - 1% - 0402; LCSC Part #: C17168; JLC Availability: Basic
MT_R_ECON_C MT_R_ECON_D MT_R_FBOUT_C MT_R_SWEN_C MT_R_SWEN_D R_1A_c R_1B_c = 0402WGF1003TCE: R - RESISTOR - SMD - 100k - 1% -  0402; LCSC Part #: C25741; JLC Availability: Basic
MT_R_FBIN_A MT_R_GVCC MT_R_SHDN_A Rbg1a Rbg2a Rtg1a Rtg2a = 0603WAF100KT5E: R - RESISTOR - SMD - 1R - 1% -  0603; LCSC Part #: C22936; JLC Availability: Basic
MT_R_FBIN_B = 0603WAF3301T5E: R - RESISTOR - SMD - 3.3k - 1% - 0603; LCSC Part #: C22978; JLC Availability: Basic
MT_R_FBIN_C = 0402WGF1502TCE: R - RESISTOR - SMD - 15k - 1% - 0402; LCSC Part #: C25756; JLC Availability: Basic
MT_R_FBIW_A = 0402WGF1501TCE: R - RESISTOR - SMD - 1.5k - 1% - 0402; LCSC Part #: C25867; JLC Availability: Basic
MT_R_FBOUT_AA MT_R_FBOUT_AB = 0603WAF1004T5E: R - RESISTOR - SMD - 1M - 1% - 0603; LCSC Part #: C22935; JLC Availability: Basic
MT_R_IMON_IN MT_R_VINR_C = 0402WGF2202TCE: R - RESISTOR - SMD - 22k - 1% - 0402; LCSC Part #: C25768; JLC Availability: Basic
MT_R_IMON_OUT = 0402WGF5602TCE: R - RESISTOR - SMD - 56k - 1% - 0402; LCSC Part #: C25796; JLC Availability: Basic
MT_R_IOR = 0402WGF3301TCE: R - RESISTOR - SMD - 3.3k - 1% - 0402; LCSC Part #: C25890; JLC Availability: Basic
MT_R_IOW R_1A_a R_1A_b R_1B_a R_1B_b = 0402WGF4702TCE: R - RESISTOR - SMD - 47k - 1% - 0402; LCSC Part #: C25792; JLC Availability: Basic
MT_R_KA MT_R_KB MT_R_SHDN_C MT_R_TA MT_R_TB MT_R_TD MT_R_TE MT_R_TEMP_A MT_R_TG MT_R_TJ MT_R_TK MT_R_VC MT_R_VINR MT_R_VINR_B Rbg1s Rbg2s Rtg1s Rtg2s = 0402WGF1002TCE: R - RESISTOR - SMD - 10k - 1% - 0402; LCSC Part #: C25744; JLC Availability: Basic
MT_R_SHDN_B = 0402WGF3302TCE: R - RESISTOR - SMD - 33k - 1% - 0402; LCSC Part #: C25779; JLC Availability: Basic
MT_R_VIN_A MT_R_VOUT_A = 0603WAF0000T5E: R - RESISTOR - SMD - 0R - 1% - 0603; LCSC Part #: C21189; JLC Availability: Basic
MT_R_VIN_B MT_R_VOUT_B = 0603WAF820JT5E: R - RESISTOR - SMD - 10 - 1% - 0603; LCSC Part #: C22859; JLC Availability: Basic
MT_REG_THREE = AMS1117-3.3: U - IC - LDO - 3.3V - 800mA; VOut: 3.3; LCSC Part #: C6186; JLC Availability: Basic
MT_RT_TA MT_RT_TB MT_RT_TD MT_RT_TE MT_RT_TG MT_RT_TJ MT_RT_TK = NCP15XH103F03RC: RT - NTC THERMISTOR - 10k - 1% - 0402; Value2: 3380k; LCSC Part #: C77131; JLC Availability: Extended
MT_U_AMP = LM324APWR: U - IC - OP AMP (QUAD); Speed: 0.4V/us; LCSC Part #: C350548; JLC Availability: Extended
MT_U_T = 74HC4067PW,118: U - IC -16 Port Analog MUX; ComponentLink1Description: Manufacturer URL; ComponentLink1URL: http://www.st.com/web/en/home.html; ComponentLink2Description: Datasheet; ComponentLink2URL: http://www.st.com/st-web-ui/static/active/en/resource/technical/document/datasheet/CD00161566.pdf; ComponentLink3Description: Package Specification; ComponentLink3URL: http://www.st.com/st-web-ui/static/active/en/resource/technical/document/datasheet/DM00058181.pdf; JLC Availability: Extended; LCSC Part #: C179326
R100-R103 = 0402WGF1000TCE: R - RESISTOR - SMD - 100R - 1% - 0402; LCSC Part #: C25076; JLC Availability: Basic
R110 R140 = 1206W4F100JT5E: R - RESISTOR - SMD - 10R - 1% - 1206; LCSC Part #: C17903; JLC Availability: Basic
TWLV_C_AA TWLV_C_AB TWLV_C_AC TWLV_C_AD TWLV_C_AE TWLV_C_AF TWLV_C_AG TWLV_C_AH TWLV_C_AI TWLV_C_AJ TWLV_C_AK TWLV_C_AL TWLV_C_AM TWLV_C_AN TWLV_C_AO TWLV_C_AP TWLV_C_AQ TWLV_C_AR TWLV_C_AS TWLV_C_AT TWLV_C_AU TWLV_C_AV TWLV_C_AW TWLV_C_AX TWLV_C_AY TWLV_C_AZ TWLV_C_BA TWLV_C_BB TWLV_C_BC TWLV_C_BD TWLV_C_BE TWLV_C_BF TWLV_C_BG TWLV_C_BH TWLV_C_BI TWLV_C_BJ = CL10A106MA8NRNC: C - CAPACITOR - MLCC - 10uF - 25V - 0603; WVDC: 25; LCSC Part #: C96446; Availability: Basic
TWLV_R_A = 0402WGF1004TCE: R - RESISTOR - SMD - 1M - 1% - 0402; LCSC Part #: C26083; JLC Availability: Basic
TWLV_R_C = 0402WGF1201TCE: R - RESISTOR - SMD - 1.2k - 1% - 0402; LCSC Part #: C25862; JLC Availability: Basic
TWLV_R_D = 0603WAF3900T5E: R - RESISTOR - SMD - 390R - 1% - 0603; LCSC Part #: C23151; JLC Availability: Basic
TWLV_R_E = 1206W4F100LT5E: R - RESISTOR - SMD - 0.1R - 1% - 1206; LCSC Part #: C25334; JLC Availability: Basic
U = LT8490EUKJ#PBF: Battery Charger Lead-Acid/Li-Ion 1.3V to 80V 64-Pin QFN EP Tube; MF: Analog Devices; MP: LT8490EUKJ#PBF; Value: *; SnapEDA_Link: https://www.snapeda.com/parts/LT8490EUKJ%23PBF/Analog%20Devices/view-part/4331724/?ref=snap; Availability: Unavailable; Package: QFN -58 Analog Devices; Price: None
U_TWLV_A = LM2576HVS-ADJ/TR: U - IC - BUCK CONVERTER, ADJUSTABLE, 60V, 3A; MF: Texas Instruments; Package: TO-263-5; Availability: Extended; Value: *; LCSC Part #: C234208; Texas_Instruments-Purchase-URL: https://snapeda.com/shop?store=Texas+Instruments&id=213619